# EAGLE schematic environode_display (EAGLE 6.3)
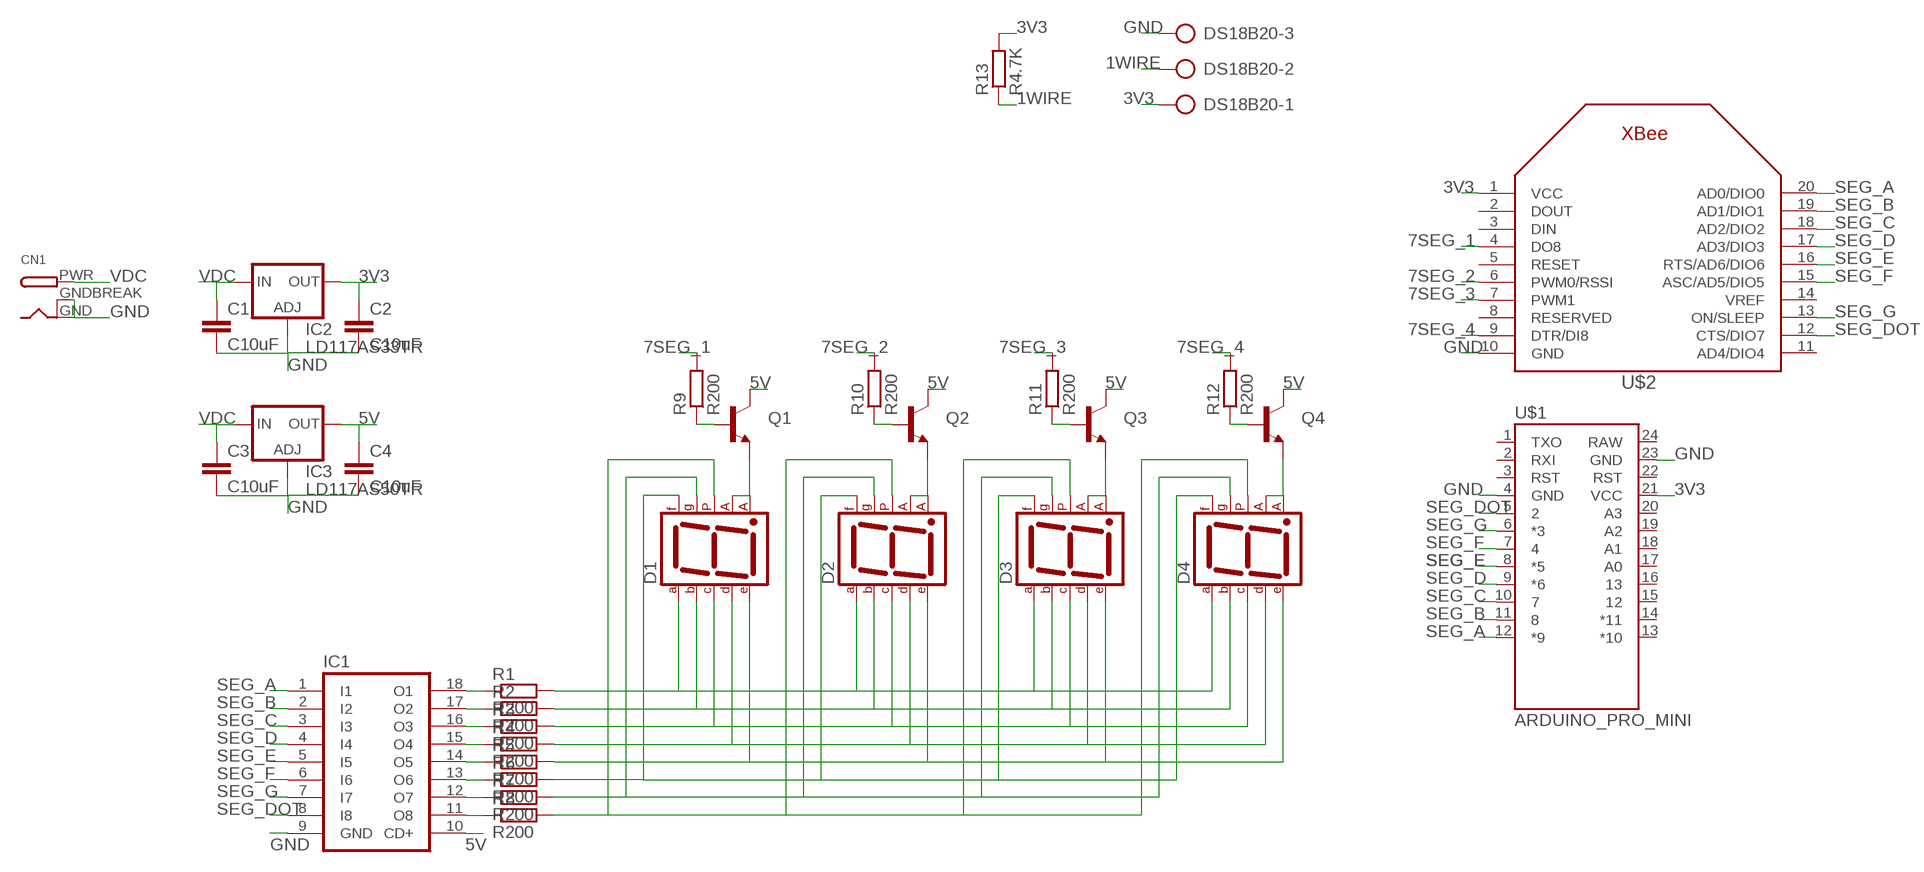
[diagram p0: schematic, sheet 1]

## Parts
C1  C10uF  C-EUC0805  [C0805]
C2  C10uF  C-EUC0805  [C0805]
C3  C10uF  C-EUC0805  [C0805]
C4  C10uF  C-EUC0805  [C0805]
CN1  DCBARRELPTH  [DCJACK_2MM_PTH]
D1  7SEG-CA  [7SEG-13]
D2  7SEG-CA  [7SEG-13]
D3  7SEG-CA  [7SEG-13]
D4  7SEG-CA  [7SEG-13]
DS18B20  AK300/3  [AK300/3]
IC1  ULN2803A  [DIL18]
IC2  LD117AS33TR  [SOT223]
IC3  LD117AS50TR  [SOT223]
Q1  TRANSISTOR_NPNP2N2222A  [TO-92]
Q2  TRANSISTOR_NPNP2N2222A  [TO-92]
Q3  TRANSISTOR_NPNP2N2222A  [TO-92]
Q4  TRANSISTOR_NPNP2N2222A  [TO-92]
R1  R200  R-EU_0309/V  [0309V]
R2  R200  R-EU_0309/V  [0309V]
R3  R200  R-EU_0309/V  [0309V]
R4  R200  R-EU_0309/V  [0309V]
R5  R200  R-EU_0309/V  [0309V]
R6  R200  R-EU_0309/V  [0309V]
R7  R200  R-EU_0309/V  [0309V]
R8  R200  R-EU_0309/V  [0309V]
R9  R200  R-EU_0309/V  [0309V]
R10  R200  R-EU_0309/V  [0309V]
R11  R200  R-EU_0309/V  [0309V]
R12  R200  R-EU_0309/V  [0309V]
R13  R4.7K  R-EU_0309/V  [0309V]
U$1  ARDUINO_PRO_MINI  [ARDUINO_PRO_MINI]
U$2  XBEE  [XBEE]

## Nets
1WIRE: DS18B20.2 R13.1
3V3: C2.1 DS18B20.1 IC2.4(OUT) R13.2 U$1.21(VCC) U$2.1(VCC)
5V: C4.1 IC1.10(CD+) IC3.4(OUT) Q1.1(C) Q2.1(C) Q3.1(C) Q4.1(C)
7SEG_1: R9.2 U$2.4(DO8)
7SEG_2: R10.2 U$2.6(PWM0/RSSI)
7SEG_3: R11.2 U$2.7(PWM1)
7SEG_4: R12.2 U$2.9(DTR/DI8)
GND: C1.2 C2.2 C3.2 C4.2 CN1.GND CN1.GNDBREAK DS18B20.3 IC1.9(GND) IC2.1(ADJ) IC3.1(ADJ) U$1.4(GND) U$1.23(GND) U$2.10(GND)
N$1: IC1.18(O1) R1.1
N$2: IC1.17(O2) R2.1
N$3: IC1.16(O3) R3.1
N$4: IC1.15(O4) R4.1
N$5: IC1.14(O5) R5.1
N$6: IC1.13(O6) R6.1
N$7: IC1.12(O7) R7.1
N$8: IC1.11(O8) R8.1
N$9: D1.7(A) D2.7(A) D3.7(A) D4.7(A) R1.2
N$10: D1.6(B) D2.6(B) D3.6(B) D4.6(B) R2.2
N$11: D1.4(C) D2.4(C) D3.4(C) D4.4(C) R3.2
N$12: D1.2(D) D2.2(D) D3.2(D) D4.2(D) R4.2
N$13: D1.1(E) D2.1(E) D3.1(E) D4.1(E) R5.2
N$14: D1.9(F) D2.9(F) D3.9(F) D4.9(F) R6.2
N$15: D1.10(G) D2.10(G) D3.10(G) D4.10(G) R7.2
N$16: D1.3(CA1) D1.8(CA2) Q1.3(E)
N$17: D2.3(CA1) D2.8(CA2) Q2.3(E)
N$18: Q1.2(B) R9.1
N$19: D1.5(DP) D2.5(DP) D3.5(DP) D4.5(DP) R8.2
N$20: D3.3(CA1) D3.8(CA2) Q3.3(E)
N$21: Q2.2(B) R10.1
N$22: D4.3(CA1) D4.8(CA2) Q4.3(E)
N$23: Q3.2(B) R11.1
N$24: Q4.2(B) R12.1
SEG_A: IC1.1(I1) U$1.12(*9) U$2.20(AD0/DIO0)
SEG_B: IC1.2(I2) U$1.11 U$2.19(AD1/DIO1)
SEG_C: IC1.3(I3) U$1.10 U$2.18(AD2/DIO2)
SEG_D: IC1.4(I4) U$1.9(*6) U$2.17(AD3/DIO3)
SEG_DOT: IC1.8(I8) U$1.5 U$2.12(CTS/DIO7)
SEG_E: IC1.5(I5) U$1.8(*5) U$2.16(RTS/AD6/DIO6)
SEG_F: IC1.6(I6) U$1.7 U$2.15(ASC/AD5/DIO5)
SEG_G: IC1.7(I7) U$1.6(*3) U$2.13(ON/SLEEP)
VDC: C1.1 C3.1 CN1.PWR IC2.3(IN) IC3.3(IN)
Unconnected: U$1.1(TXO) U$1.2(RXI) U$1.3(RST) U$1.13(*10) U$1.14(*11) U$1.15 U$1.16 U$1.17(A0) U$1.18(A1) U$1.19(A2) U$1.20(A3) U$1.22(RST) U$1.24(RAW) U$2.2(DOUT) U$2.3(DIN) U$2.5(RESET) U$2.8(RESERVED) U$2.11(AD4/DIO4) U$2.14(VREF)

## Library data of the parts
C1-C4 = resistor:C-EU: CAPACITOR, European symbol
CN1 = adafruit:DCBARREL: 2.0mm DC Barrel Jack DCJACK_2MM_PTH - Through Hole Jack (4UConnector: 05537)
D1-D4 = special:7SEG-CA: 7-segment DISPLAY single anode, 13 mm
DS18B20 = con-ptr500:AK300/3: CONNECTOR; OC_FARNELL: unknown; OC_NEWARK: unknown
IC1 = uln-udn:ULN2803A: DRIVER ARRAY
IC2 IC3 = v-reg:LD117A?*: Low drop fixed and adjustable positive voltage regulators 1 A Source: http://www.st.com/stonline/products/literature/ds/7194/ld1117axx.pdf
Q1-Q4 = SparkFun-DiscreteSemi:TRANSISTOR_NPN: Generic NPN BJT MMBT2222A - TRANS-08049 (SOT-23, 1A 40V) MPSA42 - TRANS-09116 (SOT-23, 500mA 300V) MMBT5088LT1G - TRANS-11160 (SOT-23, 50 mA 30V) BC547 - COM-08928 <http://www.sparkfun.com/products/8928> (TO-92 45V 100mA) (1.Collector 2.Base 3.Emitter) 2N3904 - COM-00521 <http://www.sparkfun.com/products/521> (TO-92 40V 200mA) (1.Emitter 2.Base 3.Collector) P2N2222A - COM-12852 <http://www.sparkfun.com/products/12852> (TO-92 40V 600mA) (1.Collector 2.Base 3.Emitter); PROD_ID: TRANS-09536
R1-R13 = resistor:R-EU_: RESISTOR, European symbol
U$1 = tigorcustom:ARDUINO_PRO_MINI
U$2 = adafruit:XBEE